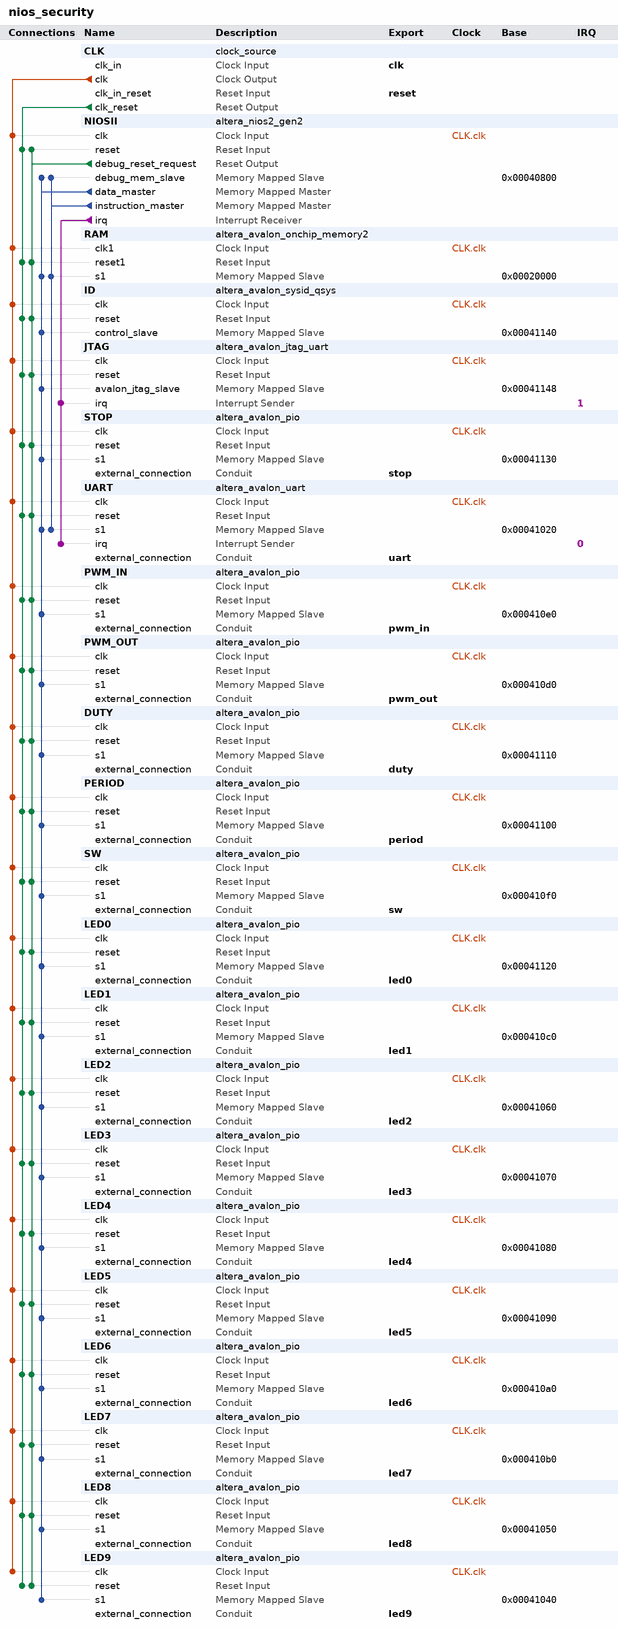
[diagram p0: system contents]
# Platform Designer (Qsys) system nios_security, MAX 10 10M50DAF484C7G
# Parameters at their usual value, and those the tool derives, are not listed.
package require -exact qsys 18.1
create_system nios_security
set_project_property DEVICE_FAMILY {MAX 10}
set_project_property DEVICE 10M50DAF484C7G

add_instance CLK clock_source 18.1
set_instance_parameter_value CLK clockFrequency 50000000

add_instance NIOSII altera_nios2_gen2 18.1
set_instance_parameter_value NIOSII dcache_size 2048
set_instance_parameter_value NIOSII exceptionSlave RAM.s1
set_instance_parameter_value NIOSII icache_size 4096
set_instance_parameter_value NIOSII impl Tiny
set_instance_parameter_value NIOSII resetSlave RAM.s1

add_instance RAM altera_avalon_onchip_memory2 18.1
set_instance_parameter_value RAM dataWidth 32
set_instance_parameter_value RAM dualPort false
set_instance_parameter_value RAM initMemContent false
set_instance_parameter_value RAM initializationFileName onchip_mem.hex
set_instance_parameter_value RAM memorySize 131072

add_instance ID altera_avalon_sysid_qsys 18.1
set_instance_parameter_value ID id 0

add_instance JTAG altera_avalon_jtag_uart 18.1
set_instance_parameter_value JTAG simInteractiveOptions NO_INTERACTIVE_WINDOWS

add_instance STOP altera_avalon_pio 18.1
set_instance_parameter_value STOP direction Output
set_instance_parameter_value STOP width 32

add_instance UART altera_avalon_uart 18.1
set_instance_parameter_value UART baud 9600
set_instance_parameter_value UART dataBits 8
set_instance_parameter_value UART fixedBaud true
set_instance_parameter_value UART parity NONE
set_instance_parameter_value UART stopBits 1

add_instance PWM_IN altera_avalon_pio 18.1
set_instance_parameter_value PWM_IN direction Input
set_instance_parameter_value PWM_IN width 1

add_instance PWM_OUT altera_avalon_pio 18.1
set_instance_parameter_value PWM_OUT direction Output
set_instance_parameter_value PWM_OUT width 1

add_instance DUTY altera_avalon_pio 18.1
set_instance_parameter_value DUTY direction Output
set_instance_parameter_value DUTY width 32

add_instance PERIOD altera_avalon_pio 18.1
set_instance_parameter_value PERIOD direction Output
set_instance_parameter_value PERIOD width 32

add_instance SW altera_avalon_pio 18.1
set_instance_parameter_value SW direction Input
set_instance_parameter_value SW width 1

add_instance LED0 altera_avalon_pio 18.1
set_instance_parameter_value LED0 direction Output
set_instance_parameter_value LED0 width 32

add_instance LED1 altera_avalon_pio 18.1
set_instance_parameter_value LED1 direction Output
set_instance_parameter_value LED1 width 1

add_instance LED2 altera_avalon_pio 18.1
set_instance_parameter_value LED2 direction Output
set_instance_parameter_value LED2 width 1

add_instance LED3 altera_avalon_pio 18.1
set_instance_parameter_value LED3 direction Output
set_instance_parameter_value LED3 width 1

add_instance LED4 altera_avalon_pio 18.1
set_instance_parameter_value LED4 direction Output
set_instance_parameter_value LED4 width 1

add_instance LED5 altera_avalon_pio 18.1
set_instance_parameter_value LED5 direction Output
set_instance_parameter_value LED5 width 1

add_instance LED6 altera_avalon_pio 18.1
set_instance_parameter_value LED6 direction Output
set_instance_parameter_value LED6 width 1

add_instance LED7 altera_avalon_pio 18.1
set_instance_parameter_value LED7 direction Output
set_instance_parameter_value LED7 width 1

add_instance LED8 altera_avalon_pio 18.1
set_instance_parameter_value LED8 direction Output
set_instance_parameter_value LED8 width 1

add_instance LED9 altera_avalon_pio 18.1
set_instance_parameter_value LED9 direction Output
set_instance_parameter_value LED9 width 1

# connections
add_connection CLK.clk DUTY.clk clock
add_connection CLK.clk ID.clk clock
add_connection CLK.clk JTAG.clk clock
add_connection CLK.clk LED0.clk clock
add_connection CLK.clk LED1.clk clock
add_connection CLK.clk LED2.clk clock
add_connection CLK.clk LED3.clk clock
add_connection CLK.clk LED4.clk clock
add_connection CLK.clk LED5.clk clock
add_connection CLK.clk LED6.clk clock
add_connection CLK.clk LED7.clk clock
add_connection CLK.clk LED8.clk clock
add_connection CLK.clk LED9.clk clock
add_connection CLK.clk NIOSII.clk clock
add_connection CLK.clk PERIOD.clk clock
add_connection CLK.clk PWM_IN.clk clock
add_connection CLK.clk PWM_OUT.clk clock
add_connection CLK.clk RAM.clk1 clock
add_connection CLK.clk STOP.clk clock
add_connection CLK.clk SW.clk clock
add_connection CLK.clk UART.clk clock
add_connection CLK.clk_reset DUTY.reset reset
add_connection CLK.clk_reset ID.reset reset
add_connection CLK.clk_reset JTAG.reset reset
add_connection CLK.clk_reset LED0.reset reset
add_connection CLK.clk_reset LED1.reset reset
add_connection CLK.clk_reset LED2.reset reset
add_connection CLK.clk_reset LED3.reset reset
add_connection CLK.clk_reset LED4.reset reset
add_connection CLK.clk_reset LED5.reset reset
add_connection CLK.clk_reset LED6.reset reset
add_connection CLK.clk_reset LED7.reset reset
add_connection CLK.clk_reset LED8.reset reset
add_connection CLK.clk_reset LED9.reset reset
add_connection CLK.clk_reset NIOSII.reset reset
add_connection CLK.clk_reset PERIOD.reset reset
add_connection CLK.clk_reset PWM_IN.reset reset
add_connection CLK.clk_reset PWM_OUT.reset reset
add_connection CLK.clk_reset RAM.reset1 reset
add_connection CLK.clk_reset STOP.reset reset
add_connection CLK.clk_reset SW.reset reset
add_connection CLK.clk_reset UART.reset reset
add_connection NIOSII.debug_reset_request DUTY.reset reset
add_connection NIOSII.debug_reset_request ID.reset reset
add_connection NIOSII.debug_reset_request JTAG.reset reset
add_connection NIOSII.debug_reset_request LED0.reset reset
add_connection NIOSII.debug_reset_request LED1.reset reset
add_connection NIOSII.debug_reset_request LED2.reset reset
add_connection NIOSII.debug_reset_request LED3.reset reset
add_connection NIOSII.debug_reset_request LED4.reset reset
add_connection NIOSII.debug_reset_request LED5.reset reset
add_connection NIOSII.debug_reset_request LED6.reset reset
add_connection NIOSII.debug_reset_request LED7.reset reset
add_connection NIOSII.debug_reset_request LED8.reset reset
add_connection NIOSII.debug_reset_request LED9.reset reset
add_connection NIOSII.debug_reset_request NIOSII.reset reset
add_connection NIOSII.debug_reset_request PERIOD.reset reset
add_connection NIOSII.debug_reset_request PWM_IN.reset reset
add_connection NIOSII.debug_reset_request PWM_OUT.reset reset
add_connection NIOSII.debug_reset_request RAM.reset1 reset
add_connection NIOSII.debug_reset_request STOP.reset reset
add_connection NIOSII.debug_reset_request SW.reset reset
add_connection NIOSII.debug_reset_request UART.reset reset
add_connection NIOSII.data_master DUTY.s1 avalon
set_connection_parameter_value NIOSII.data_master/DUTY.s1 baseAddress 0x00041110
add_connection NIOSII.data_master ID.control_slave avalon
set_connection_parameter_value NIOSII.data_master/ID.control_slave baseAddress 0x00041140
add_connection NIOSII.data_master JTAG.avalon_jtag_slave avalon
set_connection_parameter_value NIOSII.data_master/JTAG.avalon_jtag_slave baseAddress 0x00041148
add_connection NIOSII.data_master LED0.s1 avalon
set_connection_parameter_value NIOSII.data_master/LED0.s1 baseAddress 0x00041120
add_connection NIOSII.data_master LED1.s1 avalon
set_connection_parameter_value NIOSII.data_master/LED1.s1 baseAddress 0x000410c0
add_connection NIOSII.data_master LED2.s1 avalon
set_connection_parameter_value NIOSII.data_master/LED2.s1 baseAddress 0x00041060
add_connection NIOSII.data_master LED3.s1 avalon
set_connection_parameter_value NIOSII.data_master/LED3.s1 baseAddress 0x00041070
add_connection NIOSII.data_master LED4.s1 avalon
set_connection_parameter_value NIOSII.data_master/LED4.s1 baseAddress 0x00041080
add_connection NIOSII.data_master LED5.s1 avalon
set_connection_parameter_value NIOSII.data_master/LED5.s1 baseAddress 0x00041090
add_connection NIOSII.data_master LED6.s1 avalon
set_connection_parameter_value NIOSII.data_master/LED6.s1 baseAddress 0x000410a0
add_connection NIOSII.data_master LED7.s1 avalon
set_connection_parameter_value NIOSII.data_master/LED7.s1 baseAddress 0x000410b0
add_connection NIOSII.data_master LED8.s1 avalon
set_connection_parameter_value NIOSII.data_master/LED8.s1 baseAddress 0x00041050
add_connection NIOSII.data_master LED9.s1 avalon
set_connection_parameter_value NIOSII.data_master/LED9.s1 baseAddress 0x00041040
add_connection NIOSII.data_master NIOSII.debug_mem_slave avalon
set_connection_parameter_value NIOSII.data_master/NIOSII.debug_mem_slave baseAddress 0x00040800
add_connection NIOSII.data_master PERIOD.s1 avalon
set_connection_parameter_value NIOSII.data_master/PERIOD.s1 baseAddress 0x00041100
add_connection NIOSII.data_master PWM_IN.s1 avalon
set_connection_parameter_value NIOSII.data_master/PWM_IN.s1 baseAddress 0x000410e0
add_connection NIOSII.data_master PWM_OUT.s1 avalon
set_connection_parameter_value NIOSII.data_master/PWM_OUT.s1 baseAddress 0x000410d0
add_connection NIOSII.data_master RAM.s1 avalon
set_connection_parameter_value NIOSII.data_master/RAM.s1 baseAddress 0x00020000
add_connection NIOSII.data_master STOP.s1 avalon
set_connection_parameter_value NIOSII.data_master/STOP.s1 baseAddress 0x00041130
add_connection NIOSII.data_master SW.s1 avalon
set_connection_parameter_value NIOSII.data_master/SW.s1 baseAddress 0x000410f0
add_connection NIOSII.data_master UART.s1 avalon
set_connection_parameter_value NIOSII.data_master/UART.s1 baseAddress 0x00041020
add_connection NIOSII.instruction_master NIOSII.debug_mem_slave avalon
set_connection_parameter_value NIOSII.instruction_master/NIOSII.debug_mem_slave baseAddress 0x00040800
add_connection NIOSII.instruction_master RAM.s1 avalon
set_connection_parameter_value NIOSII.instruction_master/RAM.s1 baseAddress 0x00020000
add_connection NIOSII.instruction_master UART.s1 avalon
set_connection_parameter_value NIOSII.instruction_master/UART.s1 baseAddress 0x00041020
add_connection NIOSII.irq JTAG.irq interrupt
set_connection_parameter_value NIOSII.irq/JTAG.irq irqNumber 1
add_connection NIOSII.irq UART.irq interrupt
set_connection_parameter_value NIOSII.irq/UART.irq irqNumber 0

# exported interfaces
add_interface clk clock sink
set_interface_property clk EXPORT_OF CLK.clk_in
add_interface duty conduit end
set_interface_property duty EXPORT_OF DUTY.external_connection
add_interface led0 conduit end
set_interface_property led0 EXPORT_OF LED0.external_connection
add_interface led1 conduit end
set_interface_property led1 EXPORT_OF LED1.external_connection
add_interface led2 conduit end
set_interface_property led2 EXPORT_OF LED2.external_connection
add_interface led3 conduit end
set_interface_property led3 EXPORT_OF LED3.external_connection
add_interface led4 conduit end
set_interface_property led4 EXPORT_OF LED4.external_connection
add_interface led5 conduit end
set_interface_property led5 EXPORT_OF LED5.external_connection
add_interface led6 conduit end
set_interface_property led6 EXPORT_OF LED6.external_connection
add_interface led7 conduit end
set_interface_property led7 EXPORT_OF LED7.external_connection
add_interface led8 conduit end
set_interface_property led8 EXPORT_OF LED8.external_connection
add_interface led9 conduit end
set_interface_property led9 EXPORT_OF LED9.external_connection
add_interface period conduit end
set_interface_property period EXPORT_OF PERIOD.external_connection
add_interface pwm_in conduit end
set_interface_property pwm_in EXPORT_OF PWM_IN.external_connection
add_interface pwm_out conduit end
set_interface_property pwm_out EXPORT_OF PWM_OUT.external_connection
add_interface reset reset sink
set_interface_property reset EXPORT_OF CLK.clk_in_reset
add_interface stop conduit end
set_interface_property stop EXPORT_OF STOP.external_connection
add_interface sw conduit end
set_interface_property sw EXPORT_OF SW.external_connection
add_interface uart conduit end
set_interface_property uart EXPORT_OF UART.external_connection

set_interconnect_requirement {$system} qsys_mm.clockCrossingAdapter HANDSHAKE
set_interconnect_requirement {$system} qsys_mm.enableEccProtection FALSE
set_interconnect_requirement {$system} qsys_mm.insertDefaultSlave FALSE
set_interconnect_requirement {$system} qsys_mm.maxAdditionalLatency 1

save_system nios_security.qsys
